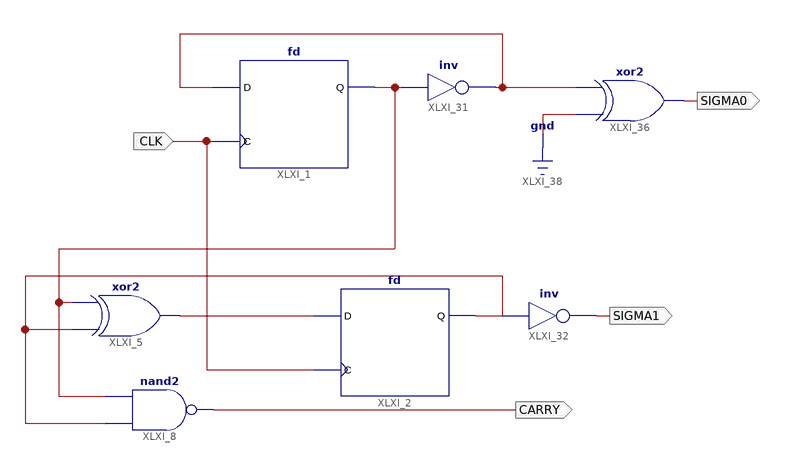
[diagram p0: schematic sheet 1]
// Xilinx ISE schematic CNT2.sch (spartan6) as structural Verilog: 7 symbols, 4 ports
module CNT2 (
  input  CLK,
  output SIGMA1,
  output CARRY,
  output SIGMA0
);

  wire SIGMA0a, SIGMA1a, XLXN_26, XLXN_46;

  fd XLXI_1 (.C(CLK), .D(XLXN_46), .Q(SIGMA0a));
  fd XLXI_2 (.C(CLK), .D(XLXN_26), .Q(SIGMA1a));
  xor XLXI_5 (XLXN_26, SIGMA1a, SIGMA0a);
  nand XLXI_8 (CARRY, SIGMA1a, SIGMA0a);
  not XLXI_31 (XLXN_46, SIGMA0a);
  not XLXI_32 (SIGMA1, SIGMA1a);
  xor XLXI_36 (SIGMA0, 1'b0, XLXN_46);
endmodule
